# EAGLE schematic FlipDot_Controller (EAGLE 8.4.1)
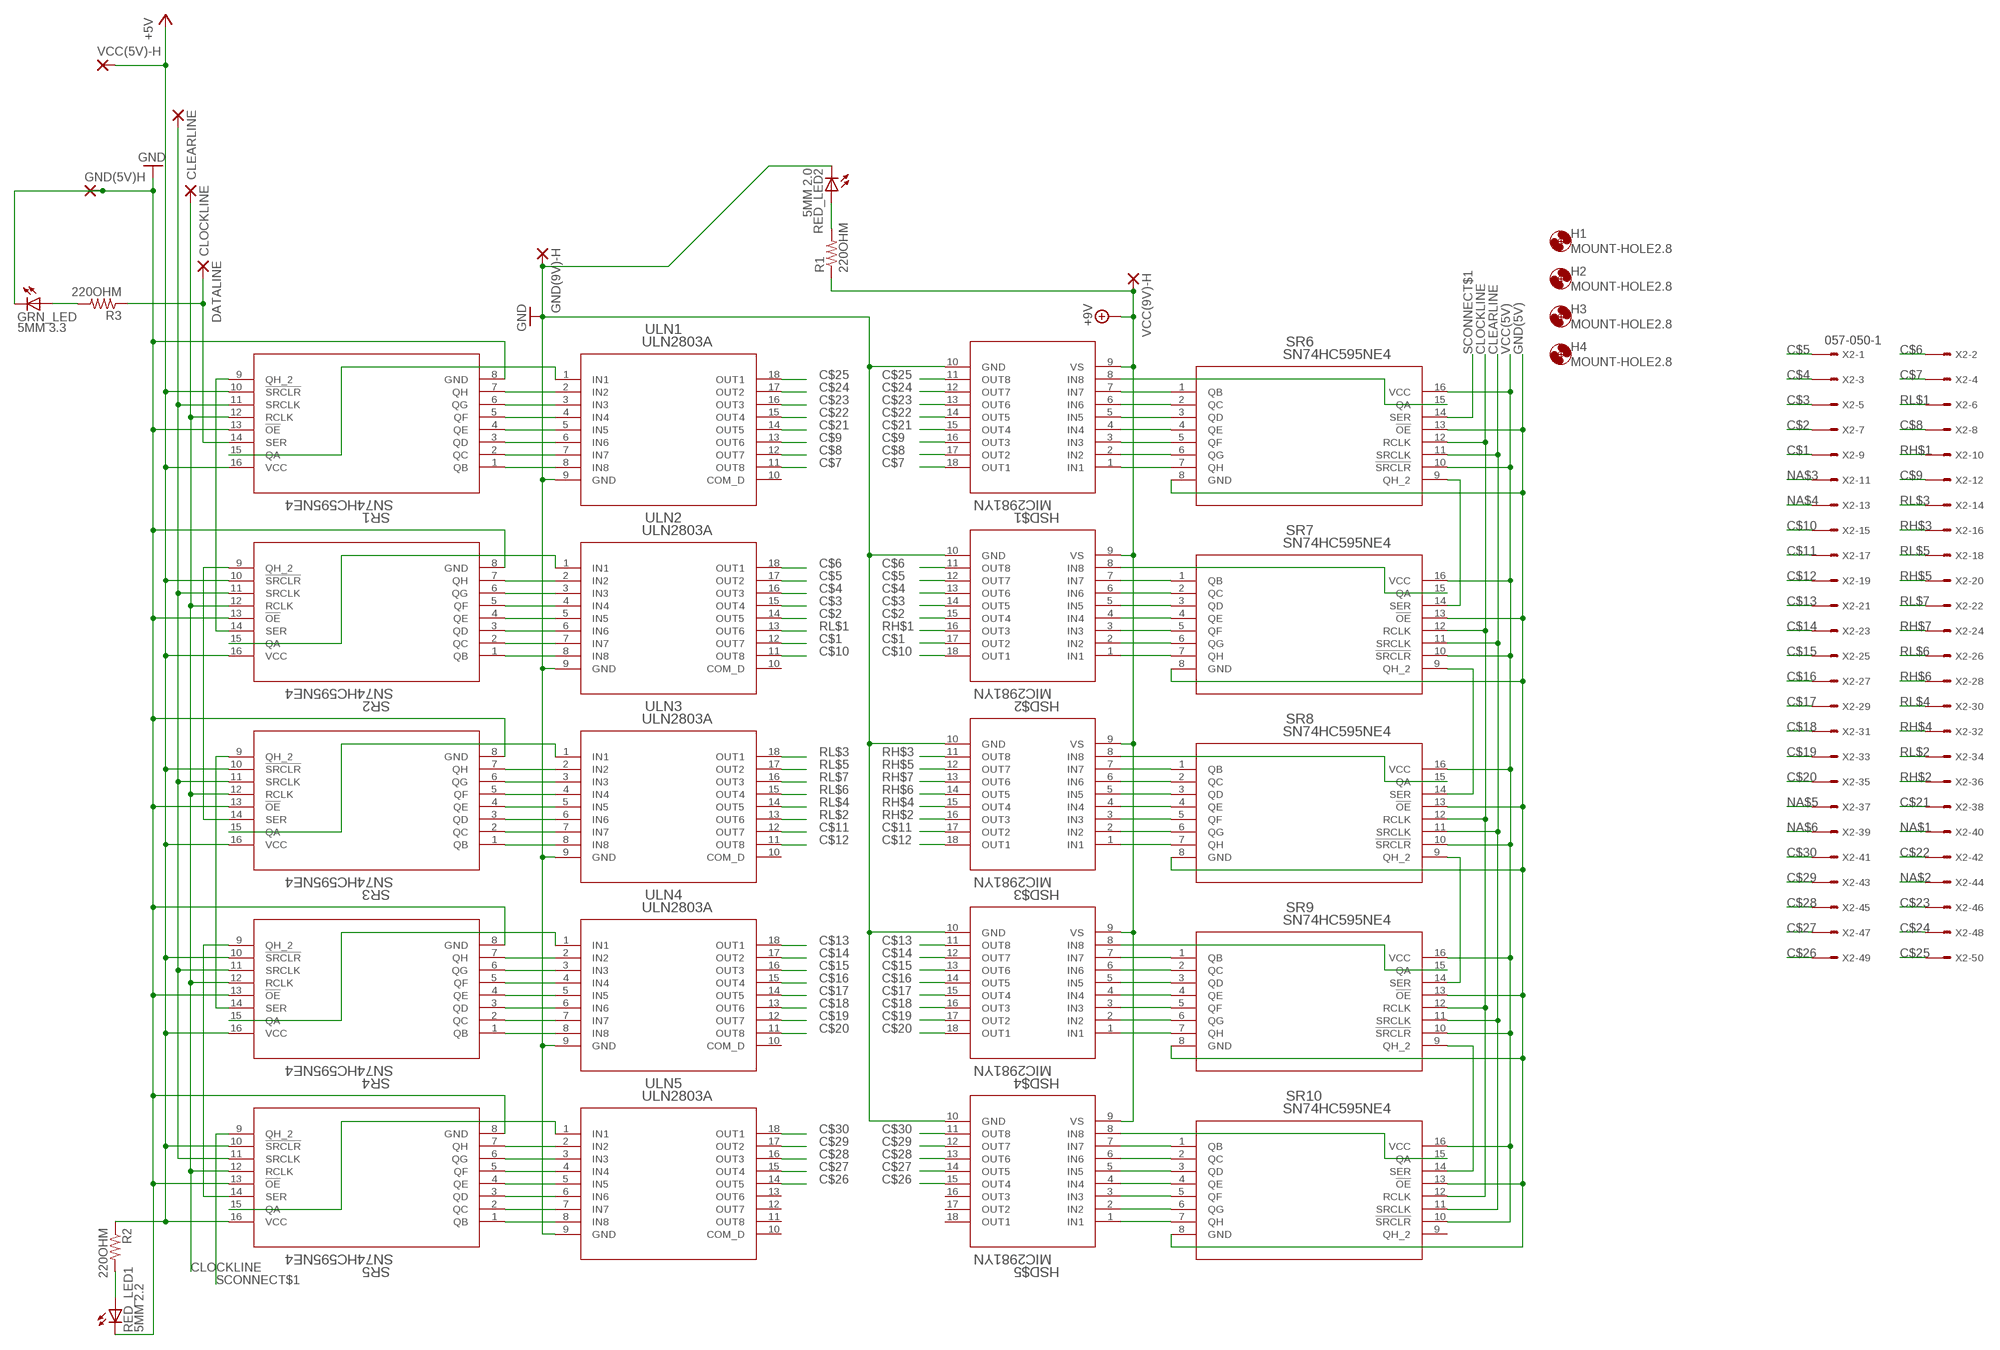
[diagram p0: schematic, sheet 1]

## Parts
CLEARLINE  WIREPAD1,6/0,8  [1,6/0,8]
CLOCKLINE  WIREPAD1,6/0,8  [1,6/0,8]
DATALINE  WIREPAD1,6/0,8  [1,6/0,8]
GND(5V)H  WIREPAD1,6/0,8  [1,6/0,8]
GND(9V)-H  WIREPAD1,6/0,8  [1,6/0,8]
GRN_LED  5MM 3.3  LED5MM  [LED5MM]
H1  MOUNT-HOLE2.8  [2,8]
H2  MOUNT-HOLE2.8  [2,8]
H3  MOUNT-HOLE2.8  [2,8]
H4  MOUNT-HOLE2.8  [2,8]
HSD$1  MIC2981YN  [PDIP-18]
HSD$2  MIC2981YN  [PDIP-18]
HSD$3  MIC2981YN  [PDIP-18]
HSD$4  MIC2981YN  [PDIP-18]
HSD$5  MIC2981YN  [PDIP-18]
R1  220OHM  R-US_0204/7  [0204/7]
R2  220OHM  R-US_0204/7  [0204/7]
R3  220OHM  R-US_0204/7  [0204/7]
RED_LED1  5MM 2.2  LED5MM  [LED5MM]
RED_LED2  5MM 2.0  LED5MM  [LED5MM]
SR1  SN74HC595NE4  [N16]
SR2  SN74HC595NE4  [N16]
SR3  SN74HC595NE4  [N16]
SR4  SN74HC595NE4  [N16]
SR5  SN74HC595NE4  [N16]
SR6  SN74HC595NE4  [N16]
SR7  SN74HC595NE4  [N16]
SR8  SN74HC595NE4  [N16]
SR9  SN74HC595NE4  [N16]
SR10  SN74HC595NE4  [N16]
ULN1  ULN2803A  [DIP-18]
ULN2  ULN2803A  [DIP-18]
ULN3  ULN2803A  [DIP-18]
ULN4  ULN2803A  [DIP-18]
ULN5  ULN2803A  [DIP-18]
VCC(5V)-H  WIREPAD1,6/0,8  [1,6/0,8]
VCC(9V)-H  WIREPAD1,6/0,8  [1,6/0,8]
X2  057-050-1  [057-050-1]

## Nets
+9V: HSD$1.9(VS) HSD$2.9(VS) HSD$3.9(VS) HSD$4.9(VS) HSD$5.9(VS) R1.1 VCC(9V)-H.1(P)
C$1: HSD$2.17(OUT2) ULN2.12(OUT7) X2.9
C$2: HSD$2.15(OUT4) ULN2.14(OUT5) X2.7
C$3: HSD$2.14(OUT5) ULN2.15(OUT4) X2.5
C$4: HSD$2.13(OUT6) ULN2.16(OUT3) X2.3
C$5: HSD$2.12(OUT7) ULN2.17(OUT2) X2.1
C$6: HSD$2.11(OUT8) ULN2.18(OUT1) X2.2
C$7: HSD$1.18(OUT1) ULN1.11(OUT8) X2.4
C$8: HSD$1.17(OUT2) ULN1.12(OUT7) X2.8
C$9: HSD$1.16(OUT3) ULN1.13(OUT6) X2.12
C$10: HSD$2.18(OUT1) ULN2.11(OUT8) X2.15
C$11: HSD$3.17(OUT2) ULN3.12(OUT7) X2.17
C$12: HSD$3.18(OUT1) ULN3.11(OUT8) X2.19
C$13: HSD$4.11(OUT8) ULN4.18(OUT1) X2.21
C$14: HSD$4.12(OUT7) ULN4.17(OUT2) X2.23
C$15: HSD$4.13(OUT6) ULN4.16(OUT3) X2.25
C$16: HSD$4.14(OUT5) ULN4.15(OUT4) X2.27
C$17: HSD$4.15(OUT4) ULN4.14(OUT5) X2.29
C$18: HSD$4.16(OUT3) ULN4.13(OUT6) X2.31
C$19: HSD$4.17(OUT2) ULN4.12(OUT7) X2.33
C$20: HSD$4.18(OUT1) ULN4.11(OUT8) X2.35
C$21: HSD$1.15(OUT4) ULN1.14(OUT5) X2.38
C$22: HSD$1.14(OUT5) ULN1.15(OUT4) X2.42
C$23: HSD$1.13(OUT6) ULN1.16(OUT3) X2.46
C$24: HSD$1.12(OUT7) ULN1.17(OUT2) X2.48
C$25: HSD$1.11(OUT8) ULN1.18(OUT1) X2.50
C$26: HSD$5.15(OUT4) ULN5.14(OUT5) X2.49
C$27: HSD$5.14(OUT5) ULN5.15(OUT4) X2.47
C$28: HSD$5.13(OUT6) ULN5.16(OUT3) X2.45
C$29: HSD$5.12(OUT7) ULN5.17(OUT2) X2.43
C$30: HSD$5.11(OUT8) ULN5.18(OUT1) X2.41
CLEARLINE: CLEARLINE.1(P) SR1.11(SRCLK) SR2.11(SRCLK) SR3.11(SRCLK) SR4.11(SRCLK) SR5.11(SRCLK) SR6.11(SRCLK) SR7.11(SRCLK) SR8.11(SRCLK) SR9.11(SRCLK) SR10.11(SRCLK)
CLOCKLINE: CLOCKLINE.1(P) SR1.12(RCLK) SR2.12(RCLK) SR3.12(RCLK) SR4.12(RCLK) SR5.12(RCLK) SR6.12(RCLK) SR7.12(RCLK) SR8.12(RCLK) SR9.12(RCLK) SR10.12(RCLK)
DATALINE: DATALINE.1(P) R3.1 SR1.14(SER)
GND(5V): GND(5V)H.1(P) GRN_LED.K(C) RED_LED1.K(C) SR1.8(GND) SR1.13(!OE) SR2.8(GND) SR2.13(!OE) SR3.8(GND) SR3.13(!OE) SR4.8(GND) SR4.13(!OE) SR5.8(GND) SR5.13(!OE) SR6.8(GND) SR6.13(!OE) SR7.8(GND) SR7.13(!OE) SR8.8(GND) SR8.13(!OE) SR9.8(GND) SR9.13(!OE) SR10.8(GND) SR10.13(!OE) ; supply symbol labelled GND
GND(9V): GND(9V)-H.1(P) HSD$1.10(GND) HSD$2.10(GND) HSD$3.10(GND) HSD$4.10(GND) HSD$5.10(GND) RED_LED2.K(C) ULN1.9(GND) ULN2.9(GND) ULN3.9(GND) ULN4.9(GND) ULN5.9(GND) ; supply symbol labelled GND
N$1: SR1.15(QA) ULN1.1(IN1)
N$2: SR1.1(QB) ULN1.8(IN8)
N$3: SR1.2(QC) ULN1.7(IN7)
N$4: SR1.3(QD) ULN1.6(IN6)
N$5: SR1.4(QE) ULN1.5(IN5)
N$6: SR1.5(QF) ULN1.4(IN4)
N$7: SR1.6(QG) ULN1.3(IN3)
N$8: SR1.9(QH_2) SR2.14(SER)
N$9: SR1.7(QH) ULN1.2(IN2)
N$10: SR6.9(QH_2) SR7.14(SER)
N$11: SR7.9(QH_2) SR8.14(SER)
N$12: SR8.9(QH_2) SR9.14(SER)
N$13: SR2.15(QA) ULN2.1(IN1)
N$14: SR2.9(QH_2) SR3.14(SER)
N$15: SR4.15(QA) ULN4.1(IN1)
N$16: SR2.7(QH) ULN2.2(IN2)
N$17: SR2.6(QG) ULN2.3(IN3)
N$18: SR2.5(QF) ULN2.4(IN4)
N$19: SR2.4(QE) ULN2.5(IN5)
N$20: SR2.3(QD) ULN2.6(IN6)
N$21: SR2.2(QC) ULN2.7(IN7)
N$22: SR3.15(QA) ULN3.1(IN1)
N$23: SR3.9(QH_2) SR4.14(SER)
N$24: SR4.9(QH_2) SR5.14(SER)
N$25: SR5.15(QA) ULN5.1(IN1)
N$26: SR4.7(QH) ULN4.2(IN2)
N$27: SR3.7(QH) ULN3.2(IN2)
N$28: SR3.6(QG) ULN3.3(IN3)
N$29: SR3.5(QF) ULN3.4(IN4)
N$30: SR3.4(QE) ULN3.5(IN5)
N$31: SR3.3(QD) ULN3.6(IN6)
N$32: SR3.2(QC) ULN3.7(IN7)
N$33: HSD$1.8(IN8) SR6.15(QA)
N$34: SR5.7(QH) ULN5.2(IN2)
N$35: HSD$1.7(IN7) SR6.1(QB)
N$36: HSD$1.6(IN6) SR6.2(QC)
N$37: SR4.6(QG) ULN4.3(IN3)
N$38: SR4.5(QF) ULN4.4(IN4)
N$39: SR4.4(QE) ULN4.5(IN5)
N$40: SR4.3(QD) ULN4.6(IN6)
N$41: SR4.2(QC) ULN4.7(IN7)
N$42: SR4.1(QB) ULN4.8(IN8)
N$43: SR5.6(QG) ULN5.3(IN3)
N$44: HSD$1.5(IN5) SR6.3(QD)
N$45: HSD$1.4(IN4) SR6.4(QE)
N$46: SR5.5(QF) ULN5.4(IN4)
N$47: SR5.4(QE) ULN5.5(IN5)
N$48: SR5.3(QD) ULN5.6(IN6)
N$49: SR5.2(QC) ULN5.7(IN7)
N$50: SR5.1(QB) ULN5.8(IN8)
N$51: HSD$1.3(IN3) SR6.5(QF)
N$52: HSD$1.2(IN2) SR6.6(QG)
N$53: HSD$1.1(IN1) SR6.7(QH)
N$54: SR9.9(QH_2) SR10.14(SER)
N$55: HSD$2.8(IN8) SR7.15(QA)
N$56: HSD$3.8(IN8) SR8.15(QA)
N$57: HSD$4.8(IN8) SR9.15(QA)
N$58: HSD$5.8(IN8) SR10.15(QA)
N$59: HSD$2.7(IN7) SR7.1(QB)
N$60: HSD$2.6(IN6) SR7.2(QC)
N$61: HSD$2.5(IN5) SR7.3(QD)
N$62: HSD$2.4(IN4) SR7.4(QE)
N$63: HSD$2.3(IN3) SR7.5(QF)
N$64: HSD$2.2(IN2) SR7.6(QG)
N$65: HSD$2.1(IN1) SR7.7(QH)
N$66: HSD$3.7(IN7) SR8.1(QB)
N$67: HSD$3.6(IN6) SR8.2(QC)
N$68: HSD$3.5(IN5) SR8.3(QD)
N$69: HSD$3.4(IN4) SR8.4(QE)
N$70: HSD$3.3(IN3) SR8.5(QF)
N$71: HSD$3.2(IN2) SR8.6(QG)
N$72: HSD$3.1(IN1) SR8.7(QH)
N$73: HSD$4.7(IN7) SR9.1(QB)
N$74: HSD$4.6(IN6) SR9.2(QC)
N$75: HSD$4.5(IN5) SR9.3(QD)
N$76: HSD$4.4(IN4) SR9.4(QE)
N$77: HSD$4.3(IN3) SR9.5(QF)
N$78: HSD$4.2(IN2) SR9.6(QG)
N$79: HSD$4.1(IN1) SR9.7(QH)
N$80: HSD$5.7(IN7) SR10.1(QB)
N$81: HSD$5.6(IN6) SR10.2(QC)
N$82: HSD$5.5(IN5) SR10.3(QD)
N$83: HSD$5.4(IN4) SR10.4(QE)
N$84: HSD$5.3(IN3) SR10.5(QF)
N$85: HSD$5.2(IN2) SR10.6(QG)
N$86: HSD$5.1(IN1) SR10.7(QH)
N$89: SR2.1(QB) ULN2.8(IN8)
N$90: SR3.1(QB) ULN3.8(IN8)
N$95: R2.2 RED_LED1.A
N$96: R1.2 RED_LED2.A
N$98: GRN_LED.A R3.2
NA$1: X2.40
NA$2: X2.44
NA$3: X2.11
NA$4: X2.13
NA$5: X2.37
NA$6: X2.39
RH$1: HSD$2.16(OUT3) X2.10
RH$2: HSD$3.16(OUT3) X2.36
RH$3: HSD$3.11(OUT8) X2.16
RH$4: HSD$3.15(OUT4) X2.32
RH$5: HSD$3.12(OUT7) X2.20
RH$6: HSD$3.14(OUT5) X2.28
RH$7: HSD$3.13(OUT6) X2.24
RL$1: ULN2.13(OUT6) X2.6
RL$2: ULN3.13(OUT6) X2.34
RL$3: ULN3.18(OUT1) X2.14
RL$4: ULN3.14(OUT5) X2.30
RL$5: ULN3.17(OUT2) X2.18
RL$6: ULN3.15(OUT4) X2.26
RL$7: ULN3.16(OUT3) X2.22
SCONNECT$1: SR5.9(QH_2) SR6.14(SER)
VCC(5V): R2.1 SR1.10(!SRCLR) SR1.16(VCC) SR2.10(!SRCLR) SR2.16(VCC) SR3.10(!SRCLR) SR3.16(VCC) SR4.10(!SRCLR) SR4.16(VCC) SR5.10(!SRCLR) SR5.16(VCC) SR6.10(!SRCLR) SR6.16(VCC) SR7.10(!SRCLR) SR7.16(VCC) SR8.10(!SRCLR) SR8.16(VCC) SR9.10(!SRCLR) SR9.16(VCC) SR10.10(!SRCLR) SR10.16(VCC) VCC(5V)-H.1(P) ; supply symbol labelled +5V
Unconnected: HSD$5.16(OUT3) HSD$5.17(OUT2) HSD$5.18(OUT1) SR10.9(QH_2) ULN1.10(COM_D) ULN2.10(COM_D) ULN3.10(COM_D) ULN4.10(COM_D) ULN5.10(COM_D) ULN5.11(OUT8) ULN5.12(OUT7) ULN5.13(OUT6)

## Library data of the parts
CLEARLINE CLOCKLINE GND(5V)H GND(9V)-H VCC(5V)-H VCC(9V)-H = wirepad:WIREPAD: Wire PAD connect wire on PCB
DATALINE = wirepad:WIREPAD: Wire PAD connect wire on PCB; SPICEPREFIX: X
GRN_LED RED_LED1 RED_LED2 = led:LED: LED OSRAM: - CHIPLED LG R971, LG N971, LY N971, LG Q971, LY Q971, LO R971, LY R971 LH N974, LH R974 LS Q976, LO Q976, LY Q976 LO Q996 - Hyper CHIPLED LW Q18S LB Q993, LB Q99A, LB R99A - SideLED LS A670, LO A670, LY A670, LG A670, LP A670 LB A673, LV A673, LT A673, LW A673 LH A674 LY A675 LS A676, LA A676, LO A676, LY A676, LW A676 LS A679, LY A679, LG A679 - Hyper Micro SIDELED® LS Y876, LA Y876, LO Y876, LY Y876 LT Y87S - SmartLED LW L88C, LW L88S LB L89C, LB L89S, LG L890 LS L89K, LO L89K, LY L89K LS L896, LA L896, LO L896, LY L896 - TOPLED LS T670, LO T670, LY T670, LG T670, LP T670 LSG T670, LSP T670, LSY T670, LOP T670, LYG T670 LG T671, LOG T671, LSG T671 LB T673, LV T673, LT T673, LW T673 LH T674 LS T676, LA T676, LO T676, LY T676, LB T676, LH T676, LSB T676, LW T676 LB T67C, LV T67C, LT T67C, LS T67K, LO T67K, LY T67K, LW E67C LS E67B, LA E67B, LO E67B, LY E67B, LB E67C, LV E67C, LT E67C LW T67C LS T679, LY T679, LG T679 LS T770, LO T770, LY T770, LG T770, LP T770 LB T773, LV T773, LT T773, LW T773 LH T774 LS E675, LA E675, LY E675, LS T675 LS T776, LA T776, LO T776, LY T776, LB T776 LHGB T686 LT T68C, LB T68C - Hyper Mini TOPLED® LB M676 - Mini TOPLED Santana® LG M470 LS M47K, LO M47K, LY M47K Source: http://www.osram.convergy.de LUXEON: - LUMILED® LXK2-PW12-R00, LXK2-PW12-S00, LXK2-PW14-U00, LXK2-PW14-V00 LXK2-PM12-R00, LXK2-PM12-S00, LXK2-PM14-U00 LXK2-PE12-Q00, LXK2-PE12-R00, LXK2-PE12-S00, LXK2-PE14-T00, LXK2-PE14-U00 LXK2-PB12-K00, LXK2-PB12-L00, LXK2-PB12-M00, LXK2-PB14-N00, LXK2-PB14-P00, LXK2-PB14-Q00 LXK2-PR12-L00, LXK2-PR12-M00, LXK2-PR14-Q00, LXK2-PR14-R00 LXK2-PD12-Q00, LXK2-PD12-R00, LXK2-PD12-S00 LXK2-PH12-R00, LXK2-PH12-S00 LXK2-PL12-P00, LXK2-PL12-Q00, LXK2-PL12-R00 Source: www.luxeon.com KINGBRIGHT: KA-3528ASYC Source: www.kingbright.com
H1-H4 = holes:MOUNT-HOLE: MOUNTING HOLE with drill center marker
HSD$1-HSD$5 = FlipDot_Controller:MIC2981YN; MANUFACTURER_PART_NUMBER: MIC2981YN; VENDOR: MICREL
R1-R3 = resistor:R-US_: RESISTOR, American symbol
SR1-SR10 = FlipDot_Controller:SN74HC595NE4; MANUFACTURER_PART_NUMBER: SN74HC595NE4; VENDOR: Vendor
ULN1-ULN5 = FlipDot_Controller:ULN2803A; MANUFACTURER_PART_NUMBER: ULN2803A; VENDOR: ST Microelectronics
X2 = con-panduit:057-050-: CONNECTOR 50-pin series 057 contact pc board low profile headers; OC_FARNELL: unknown; OC_NEWARK: unknown

## Net classes
0 default: clearance 0.205 mm